# Altium schematic sheet Measurement.SchDoc: Measurements
size A4; DrawnBy: Schuszter André
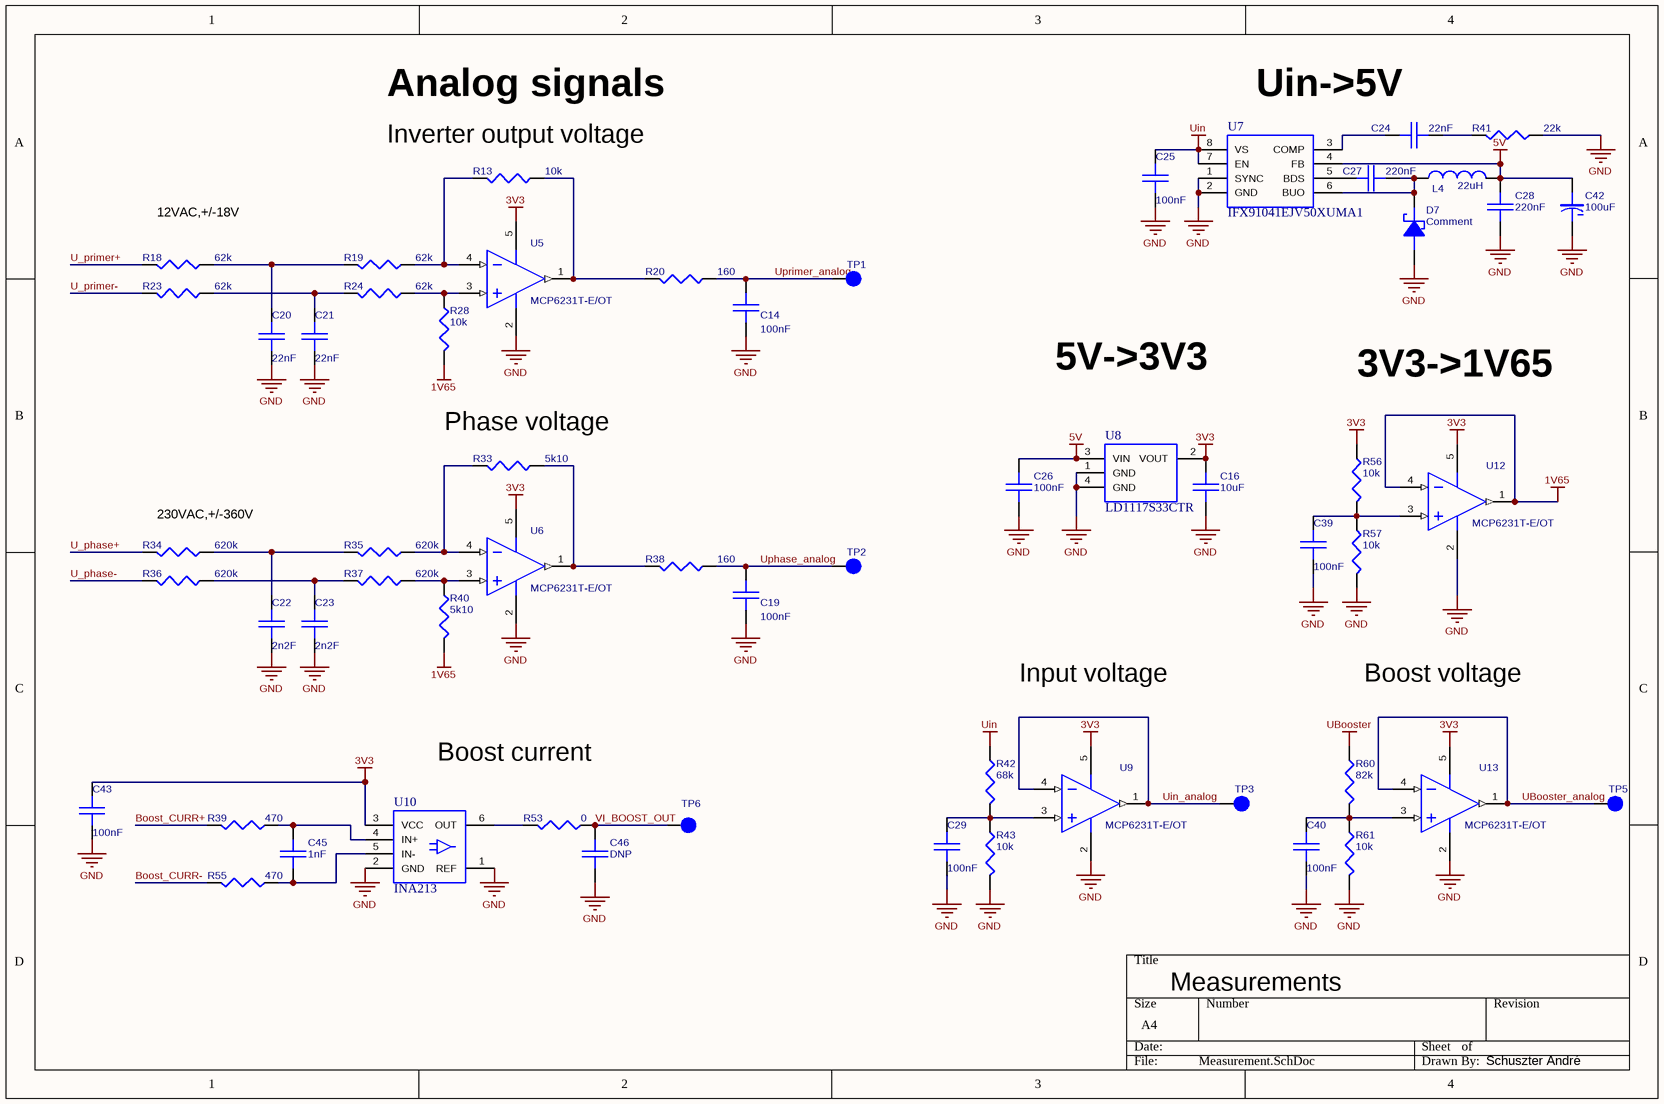
[diagram p0: Measurement.SchDoc]

## Parts
C14  100nF  [CAPC2012X06N]
C16  10uF  [CAPC2012X06N]
C19  100nF  [CAPC2012X06N]
C20  22nF  [CAPC2012X06N]
C21  22nF  [CAPC2012X06N]
C22  2n2F  [CAPC2012X06N]
C23  2n2F  [CAPC2012X06N]
C24  22nF  [CAPC2012X06N]
C25  100nF  [CAPC2012X06N]
C26  100nF  [CAPC2012X06N]
C27  220nF  [CAPC2012X06N]
C28  220nF  [CAPC2012X06N]
C29  100nF  [CAPC2012X06N]
C39  100nF  [CAPC2012X06N]
C40  100nF  [CAPC2012X06N]
C42  100uF  [CAPAE6253X61N_Buck]
C43  100nF  [CAPC2012X06N]
C45  1nF  [CAPC2012X06N]
C46  DNP  [CAPC2012X06N]
D7  Comment  [Schottky]
L4  22uH  [INDP6060X45N]
R13  10k  [RESC2012X06N]
R18  62k  [RESC2012X06N]
R19  62k  [RESC2012X06N]
R20  160  [RESC2012X06N]
R23  62k  [RESC2012X06N]
R24  62k  [RESC2012X06N]
R28  10k  [RESC2012X06N]
R33  5k10  [RESC2012X06N]
R34  620k  [RESC2012X06N]
R35  620k  [RESC2012X06N]
R36  620k  [RESC2012X06N]
R37  620k  [RESC2012X06N]
R38  160  [RESC2012X06N]
R39  470  [RESC2012X06N]
R40  5k10  [RESC2012X06N]
R41  22k  [RESC2012X06N]
R42  68k  [RESC2012X06N]
R43  10k  [RESC2012X06N]
R53  0  [RESC2012X06N]
R55  470  [RESC2012X06N]
R56  10k  [RESC2012X06N]
R57  10k  [RESC2012X06N]
R60  82k  [RESC2012X06N]
R61  10k  [RESC2012X06N]
TP1  Comment  [TP080]  (value not drawn)  (no BOM)
TP2  Comment  [TP080]  (value not drawn)  (no BOM)
TP3  Comment  [TP080]  (value not drawn)  (no BOM)
TP5  Comment  [TP080]  (value not drawn)  (no BOM)
TP6  Comment  [TP080]  (value not drawn)  (no BOM)
U5  MCP6231T-E/OT  [SOT23-5]
U6  MCP6231T-E/OT  [SOT23-5]
U7  IFX91041EJV50XUMA1  [BUCK_CONVERTER]
U8  LD1117S33CTR  [SOT230P700X180-4N]
U9  MCP6231T-E/OT  [SOT23-5]
U10  INA213  [SOT65P210X110-6N]
U12  MCP6231T-E/OT  [SOT23-5]
U13  MCP6231T-E/OT  [SOT23-5]

## Nets
1V65: R28.2 R40.2 U12.1(OUT) U12.4(IN-)
3V3: C16.2 C43.1 R56.1 U5.5(VDD) U6.5(VDD) U8.2(VOUT) U9.5(VDD) U10.3(VCC) U12.5(VDD) U13.5(VDD)
5V: C26.2 C28.2 C42.1(P) L4.2 U7.4(FB) U8.3(VIN)
GND: C14.2 C16.1 C19.2 C20.2 C21.2 C22.2 C23.2 C25.2 C26.1 C28.1 C29.2 C39.2 C40.2 C42.2(N) C43.2 C46.1 D7.A R41.1 R43.2 R57.2 R61.2 U5.2(GND) U6.2(GND) U7.1(SYNC) U7.2(GND) U8.1(GND) U8.4(GND) U9.2(GND) U10.1(REF) U10.2(GND) U12.2(GND) U13.2(GND)
UBooster: R60.1
Uin: C25.1 R42.1 U7.7(EN) U7.8(VS)
Boost_CURR+: R39.2
Boost_CURR-: R55.2
U_phase+: R34.2
U_phase-: R36.2
U_primer+: R18.2
U_primer-: R23.2
UBooster_analog: TP5.1(Pin1) U13.1(OUT) U13.4(IN-)
Uin_analog: TP3.1(Pin1) U9.1(OUT) U9.4(IN-)
Uphase_analog: C19.1 R38.1 TP2.1(Pin1)
Uprimer_analog: C14.1 R20.1 TP1.1(Pin1)
VI_BOOST_OUT: C46.2 R53.1 TP6.1(Pin1)
NetC20_1: C20.1 R18.1 R19.2
NetC21_1: C21.1 R23.1 R24.2
NetC22_1: C22.1 R34.1 R35.2
NetC23_1: C23.1 R36.1 R37.2
NetC24_1: C24.1 U7.3(COMP)
NetC24_2: C24.2 R41.2
NetC27_1: C27.1 U7.5(BDS)
NetC27_2: C27.2 D7.C L4.1 U7.6(BUO)
NetC29_1: C29.1 R42.2 R43.1 U9.3(IN+)
NetC39_1: C39.1 R56.2 R57.1 U12.3(IN+)
NetC40_1: C40.1 R60.2 R61.1 U13.3(IN+)
NetC45_1: C45.1 R55.1 U10.5(IN-)
NetC45_2: C45.2 R39.1 U10.4(IN+)
NetR13_1: R13.1 R20.2 U5.1(OUT)
NetR13_2: R13.2 R19.1 U5.4(IN-)
NetR24_1: R24.1 R28.1 U5.3(IN+)
NetR33_1: R33.1 R38.2 U6.1(OUT)
NetR33_2: R33.2 R35.1 U6.4(IN-)
NetR37_1: R37.1 R40.1 U6.3(IN+)
NetR53_2: R53.2 U10.6(OUT)

## Notes on the sheet
- Analog signals
- Uin->5V
- (near R13) Inverter output voltage
- (near R18) 12VAC,+/-18V
- 5V->3V3
- 3V3->1V65
- (near R33) Phase voltage
- (near R34) 230VAC,+/-360V
- Input voltage
- Boost voltage
- Boost current

## Library data of the parts
C14 C19 C25 C26 C29 C39 C40 C43 = CAPC: 82-07-32
C16 = CAPC: 82-10-67
C20 C21 C24 = CAPC: 82-00-77
C22 C23 = CAPC: 82-07-24
C27 C28 = CAPC: 82-03-85
C42 = CAPAE: 2068653; Part number: EDK107M016A9GAA; Supplier: Farnell; Code: 2068653
C45 = CAPC: 82-00-75
C46 = CAPC
D7 = DIO_SCHTTKY: 83-02-47; Part number: 1A 40V DO-214AC SCH.RECT. SS14; Code: 83-02-47; Supplier: Lomex
L4 = IND: 2066673; Part number: LQH6PPN470M43L; Code: 74404064220; Supplier: Farnell
R13 R28 R43 R56 R57 R61 = RES_US_HOR: 80-10-98
R18 R19 R23 R24 = RES_US_HOR: 80-11-30
R20 R38 = RES_US_HOR: 81-02-25
R33 R40 = RES_US_HOR: 80-14-91
R34-R37 = RES_US_HOR: 80-15-81
R39 R55 = RES_US_HOR: 81-10-83
R41 = RES_US_HOR: 81-11-03
R42 = RES_US_HOR: 80-11-08
R53 = RES_US_HOR: 81-10-02
R60 = RES_US_HOR: 80-11-09
TP1-TP3 TP5 TP6 = TP_SMD
U5 U6 U9 U12 U13 = követőerősítő: 1840879; Supplier: Lomex; Part number: MCP6231T-E/OT; Code: 1840879
U7 = 5V_BUCK: 2432504; Supplier: Farnell; Code: 2432504; Part number: IFX91041EJV50XUMA1
U8 = LDO5V-3V3: 1467779; Supplier: Farnell; Part number: LD1117S33CTR; Code: 1467779
U10 = INA213: 1754261; Part number: INA213AIDCKT; Code: 1754261; Supplier: Farnell